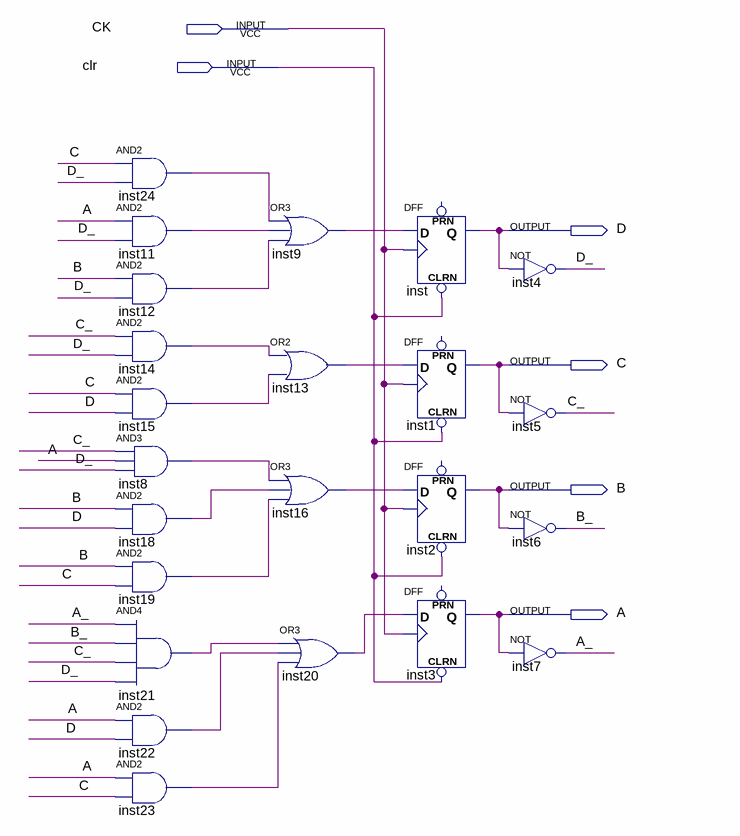
[diagram p0: schematic sheet]
// Quartus schematic L10downto0.bdf as structural Verilog: 23 symbols, 6 pins
module L10downto0 (
  input  CK,
  input  clr,
  output D,
  output C,
  output B,
  output A
);

  wire A_, B_, C_, D_, inst8_out, inst9_out, inst11_out, inst12_out, inst13_out, inst14_out, inst15_out,
       inst16_out, inst18_out, inst19_out, inst20_out, inst21_out, inst22_out, inst23_out, inst24_out;

  and inst24 (inst24_out, C, D_);
  and inst11 (inst11_out, A, D_);
  and inst12 (inst12_out, B, D_);
  and inst14 (inst14_out, C_, D_);
  and inst15 (inst15_out, C, D);
  and inst8 (inst8_out, C_, A, D_);
  and inst18 (inst18_out, B, D);
  and inst19 (inst19_out, B, C);
  and inst21 (inst21_out, A_, B_, C_, D_);
  and inst22 (inst22_out, A, D);
  and inst23 (inst23_out, A, C);
  or inst9 (inst9_out, inst24_out, inst11_out, inst12_out);
  or inst13 (inst13_out, inst14_out, inst15_out);
  or inst16 (inst16_out, inst8_out, inst18_out, inst19_out);
  or inst20 (inst20_out, inst21_out, inst22_out, inst23_out);
  DFF inst (.CLRN(clr), .CLK(CK), .D(inst9_out), .Q(D));  // open: PRN
  DFF inst1 (.CLRN(clr), .CLK(CK), .D(inst13_out), .Q(C));  // open: PRN
  DFF inst2 (.CLRN(clr), .CLK(CK), .D(inst16_out), .Q(B));  // open: PRN
  DFF inst3 (.CLRN(clr), .CLK(CK), .D(inst20_out), .Q(A));  // open: PRN
  not inst4 (D_, D);
  not inst5 (C_, C);
  not inst6 (B_, B);
  not inst7 (A_, A);
endmodule
